# EAGLE design Pressure Sensor Platform (EAGLE 9.0.1)
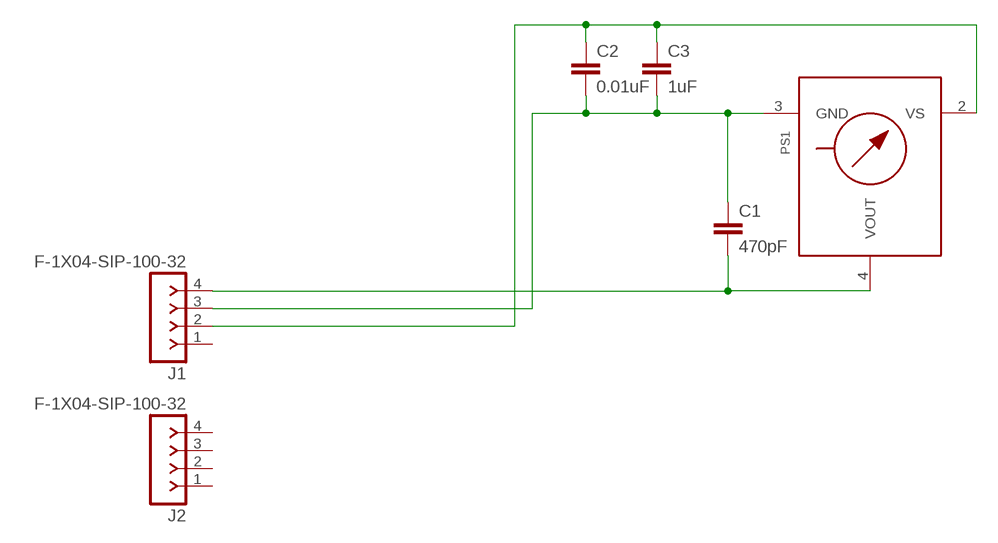
[diagram p0: schematic, sheet 1]

## Parts
C1  470pF  0.1UF-KIT-EZ-50V-20%  [CAP-PTH-SMALL-KIT]
C2  0.01uF  0.1UF-KIT-EZ-50V-20%  [CAP-PTH-SMALL-KIT]
C3  1uF  0.1UF-KIT-EZ-50V-20%  [CAP-PTH-SMALL-KIT]
J1  F-1X04-SIP-100-32  [SIP-100-04-32]
J2  F-1X04-SIP-100-32  [SIP-100-04-32]
PS1  MPX-1351  [1351]

## Nets
COM: C2.1 C3.1 J1.2 PS1.2(VS)
N$1: C1.1 C2.2 C3.2 J1.3 PS1.3(GND)
N$3: C1.2 J1.4 PS1.4(VOUT)
Unconnected: J1.1 J2.1 J2.2 J2.3 J2.4 PS1.1(NC) PS1.5(NC) PS1.6(NC)

## Library data of the parts
C1-C3 = MMC Eagle:0.1UF: 0.1µF ceramic capacitors A capacitor is a passive two-terminal electrical component used to store electrical energy temporarily in an electric field.; PROD_ID: CAP-08370; VALUE: 0.1uF
J1 J2 = MMC Eagle:F-1X04-: FEMALE HEADER
PS1 = MMC Eagle:MPX*****: Generic MPX pressure sensor

## Net classes
0 default: width 0.305 mm, drill 0.254 mm, clearance 0.381 mm

## Board
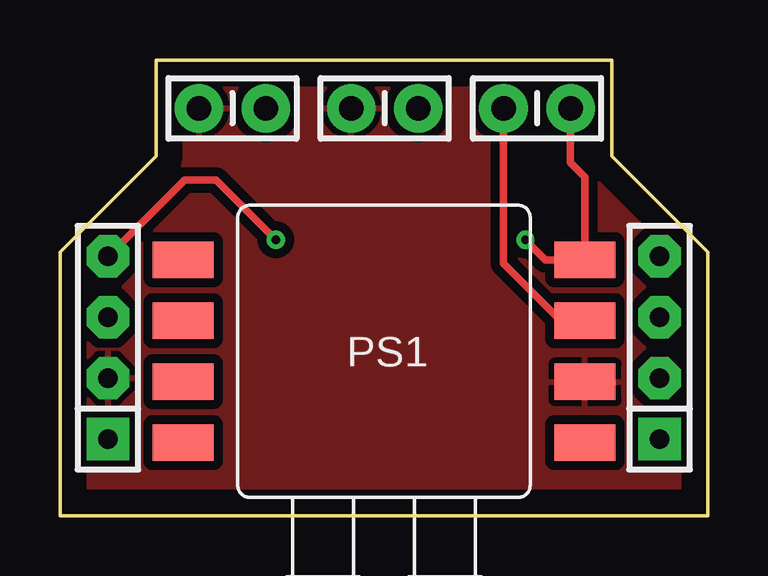
[diagram p1: board, top side]
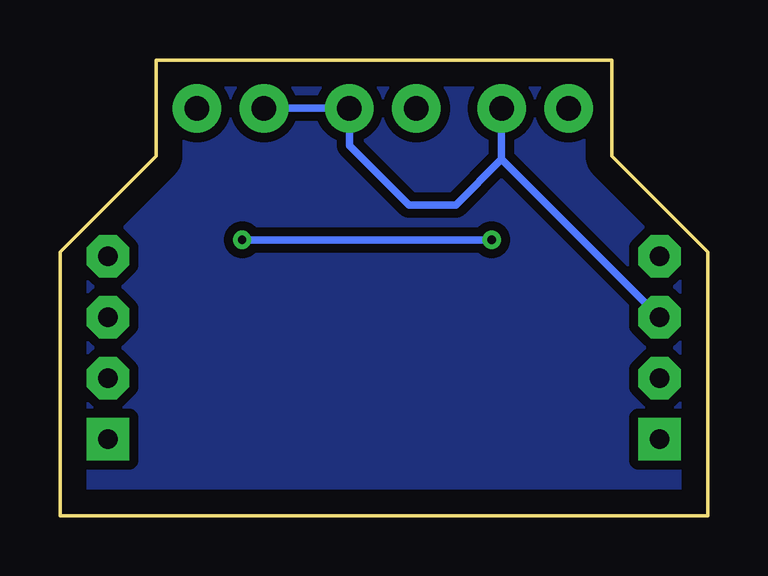
[diagram p2: board, bottom side, seen from below]

Size 27 x 19 mm. Coordinates in mm from the lower left corner, seen from the top.
Outline: 0,0 27,0 27,11 23,15 23,19 4,19 4,15 0,11 0,0
Copper layers (1*16): Top 0.035mm / dielectric 1.5mm / Bottom 0.035mm
Design rules "default": minimum track width 6mil, minimum drill 0.35mm, track to track 6mil, track to pad 6mil, pad to pad 6mil, via to via 6mil, smd to smd 6mil, copper to edge 40mil, drill to drill 6mil, minimum pad ring 10mil, minimum via ring 8mil, stop-mask expansion 4mil, vias tented up to drill 0mil, thermal gap 10mil

### Footprints (pad centres in the part's own frame; a part is rotated, then mirrored left to right if it is on the bottom)
CAP-PTH-SMALL-KIT = drill 1.016 pad 2.032: 1 -1.397,0; 2 1.397,0
SIP-100-04-32 = drill 0.813 pad 1.778 square: 1 -3.81,0 | drill 0.813 pad 1.778 octagon: 2 -1.27,0; 3 1.27,0; 4 3.81,0
1351 = smd 2.54 x 1.524: 1 8.382,-3.81; 2 8.382,-1.27; 3 8.382,1.27; 4 8.382,3.81; 5 -8.382,3.81; 6 -8.382,1.27; 7 -8.382,-1.27; 8 -8.382,-3.81

### Placement (x,y rotation side)
C1  19.89,16.98 0 top
C2  13.54,16.98 0 top
C3  7.19,16.98 0 top
J1  2,7 90 top
J2  25,7 90 top
PS1  13.51,6.85 0 top

### Tracks (layer width: path | path; a pad name or v marks a point on that pad's centre or on a via)
COM
  pour Top: 0,0 27,0 27,11 23,15 23,19 4,19 4,15 0,11
GND
  pour Bottom: 27,0 0,0 0,11 4,15 4,19 23,19 23,15 27,11
N$1
  Top 0.305: PS1.3 20.88,8.12 18.49,10.51 C1.1
  Bottom 0.305: J1.3 8.59,14.86 | 8.59,14.86 C3.2 | 8.59,14.86 10.5,12.94 12.44,12.94 14.94,15.44 C2.2 C1.1
N$3  (via drill 0.35)
  Top 0.305: C1.2 21.29,14.71 21.89,14.11 PS1.4 20.25,10.66 v19.41,11.5 | v9,11.5 6.5,14 5.19,14 J1.4
  Bottom 0.305: 19.5,11.5 v19.41,11.5 v9,11.5